# Altium project VXL_main.PrjPcb
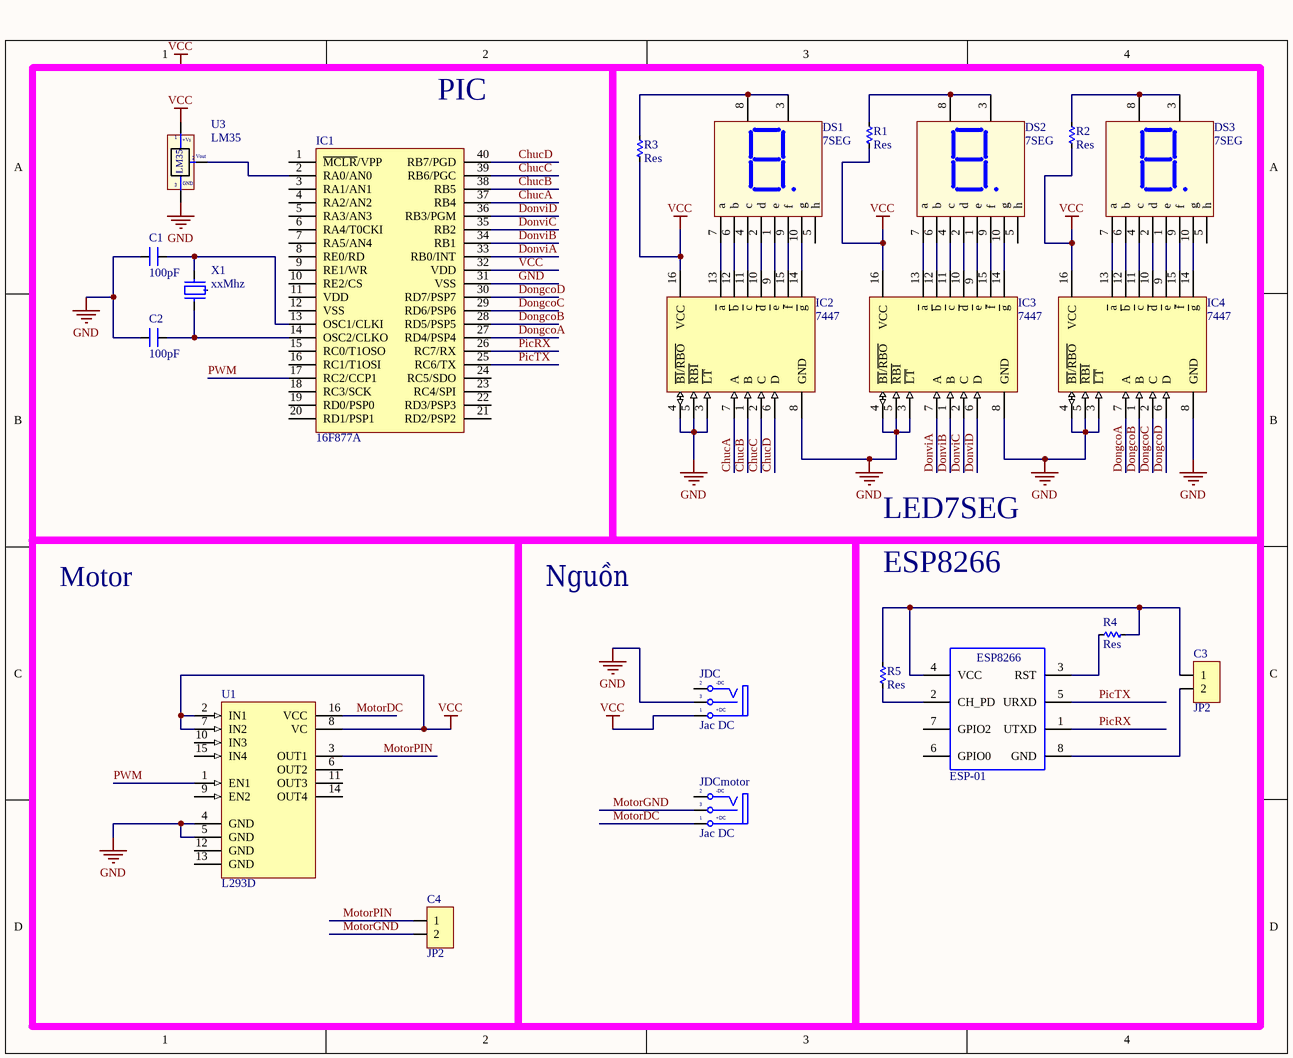
[diagram p0: AT long bus (13.3 x 4.2 inches).schdoc]
1 sheet, 22 parts. Net scope: global (net labels, ports and power ports of the same name join across sheets).
Board file: AT long bus (13.3 x 4.2 inches).PCBDOC

## Sheet AT long bus (13.3 x 4.2 inches).schdoc: AT long bus (13.3 x 4.2 inches)
size A; Organization: Organization; Address1: Address1; Address2: Address2; Address3: Address3; Address4: Address4; DocumentNumber: 1; Revision: 0; SheetNumber: 2; SheetTotal: 2

### Parts
C1  100pF  [CN1]
C2  100pF  [CN1]
C3  JP2  [JP2-C1T]
C4  JP2  [JP2-C1T]
DS1  7SEG  [LED7SEG-1-0.56]
DS2  7SEG  [LED7SEG-1-0.56]
DS3  7SEG  [LED7SEG-1-0.56]
IC1  16F877A  [DIP40/W0.6]
IC2  7447  [DIP16/W0.3]
IC3  7447  [DIP16/W0.3]
IC4  7447  [DIP16/W0.3]
JDC  Jac DC  [DC-IN]
JDCmotor  Jac DC  [DC0]
R1  Res  [RES-1/2W]
R2  Res  [RES-1/2W]
R3  Res  [RES-1/2W]
R4  Res  [RES-1/2W]
R5  Res  [RES-1/2W]
U1  L293D  [DIP16]
U2  ESP-01  [ESP8266]
U3  LM35  [TO92-123]
X1  xxMhz  [XT3]

### Blocks framed on the sheet
PIC: C1 C2 IC1 U3 X1
LED7SEG: DS1-DS3 IC2-IC4 R1-R3
Motor: C4 U1
Nguồn: JDC JDCmotor

### Nets
GND: C1.1 C2.1 IC1.31(VSS) IC2.3(~{LT}) IC2.4(~{BI}/~{RBO}) IC2.5(~{RBI}) IC2.8(GND) IC3.3(~{LT}) IC3.4(~{BI}/~{RBO}) IC3.5(~{RBI}) IC3.8(GND) IC4.3(~{LT}) IC4.4(~{BI}/~{RBO}) IC4.5(~{RBI}) IC4.8(GND) JDC.3(S) U1.4(GND) U1.5(GND) U3.3(-)
VCC: IC1.32(VDD) IC2.16(VCC) IC3.16(VCC) IC4.16(VCC) JDC.1(T) R1.2 R2.2 R3.2 U1.2(IN1) U1.7(IN2) U1.8(VC) U3.1(+Vs)
ChucA: IC1.37(RB4) IC2.7(A)
ChucB: IC1.38(RB5) IC2.1(B)
ChucC: IC1.39(RB6/PGC) IC2.2(C)
ChucD: IC1.40(RB7/PGD) IC2.6(D)
DongcoA: IC1.27(RD4/PSP4) IC4.7(A)
DongcoB: IC1.28(RD5/PSP5) IC4.1(B)
DongcoC: IC1.29(RD6/PSP6) IC4.2(C)
DongcoD: IC1.30(RD7/PSP7) IC4.6(D)
DonviA: IC1.33(RB0/INT) IC3.7(A)
DonviB: IC1.34(RB1) IC3.1(B)
DonviC: IC1.35(RB2) IC3.2(C)
DonviD: IC1.36(RB3/PGM) IC3.6(D)
MotorDC: JDCmotor.1(T) U1.16(VCC)
MotorGND: C4.2 JDCmotor.3(S)
MotorPIN: C4.1 U1.3(OUT1)
PicRX: IC1.26(RC7/RX) U2.1(UTXD)
PicTX: IC1.25(RC6/TX) U2.5(URXD)
PWM: IC1.17(RC2/CCP1) U1.1(EN1)
NetC1_2: C1.2 IC1.13(OSC1/CLKI) X1.2
NetC2_2: C2.2 IC1.14(OSC2/CLKO) X1.1
NetC3_1: C3.1 R4.1 R5.1 U2.4(VCC)
NetC3_2: C3.2 U2.8(GND)
NetDS1_1: DS1.1(e) IC2.9(~{e})
NetDS1_2: DS1.2(d) IC2.10(~{d})
NetDS1_3: DS1.3(Vcc) DS1.8(Vcc) R3.1
NetDS1_4: DS1.4(c) IC2.11(~{c})
NetDS1_6: DS1.6(b) IC2.12(~{b})
NetDS1_7: DS1.7(a) IC2.13(~{a})
NetDS1_9: DS1.9(f) IC2.15(~{f})
NetDS1_10: DS1.10(g) IC2.14(~{g})
NetDS2_1: DS2.1(e) IC3.9(~{e})
NetDS2_2: DS2.2(d) IC3.10(~{d})
NetDS2_3: DS2.3(Vcc) DS2.8(Vcc) R1.1
NetDS2_4: DS2.4(c) IC3.11(~{c})
NetDS2_6: DS2.6(b) IC3.12(~{b})
NetDS2_7: DS2.7(a) IC3.13(~{a})
NetDS2_9: DS2.9(f) IC3.15(~{f})
NetDS2_10: DS2.10(g) IC3.14(~{g})
NetDS3_1: DS3.1(e) IC4.9(~{e})
NetDS3_2: DS3.2(d) IC4.10(~{d})
NetDS3_3: DS3.3(Vcc) DS3.8(Vcc) R2.1
NetDS3_4: DS3.4(c) IC4.11(~{c})
NetDS3_6: DS3.6(b) IC4.12(~{b})
NetDS3_7: DS3.7(a) IC4.13(~{a})
NetDS3_9: DS3.9(f) IC4.15(~{f})
NetDS3_10: DS3.10(g) IC4.14(~{g})
NetIC1_2: IC1.2(RA0/AN0) U3.2(Vout)
NetR4_2: R4.2 U2.3(RST)
NetR5_2: R5.2 U2.2(CH_PD)

Not connected (* = marked no-connect by the designer): DS1 5(h); DS2 5(h); DS3 5(h); IC1 1(~{MCLR}/VPP) 3(RA1/AN1) 4(RA2/AN2) 5(RA3/AN3) 6(RA4/T0CKI) 7(RA5/AN4) 8(RE0/RD) 9(RE1/WR) 10(RE2/CS) 11(VDD) 12(VSS) 15(RC0/T1OSO) 16(RC1/T1OSI) 18(RC3/SCK) 19(RD0/PSP0) 20(RD1/PSP1) 21(RD2/PSP2) 22(RD3/PSP3) 23(RC4/SPI) 24(RC5/SDO); JDC 2(TN); JDCmotor 2(TN); U1 6(OUT2) 9(EN2) 10(IN3) 11(OUT3) 12(GND) 13(GND) 14(OUT4) 15(IN4); U2 6(GPIO0) 7(GPIO2); X1 3

### Notes on the sheet
- ESP8266
- Labels drawn without touching a wire or pin: VCC
- (in symbol DCIN) -DC; +DC
- (in symbol ESP8266-01) ESP8266
- (in symbol LM35) GND

### Library data of the parts
C1 C2 = CN1: Cap np  1pF - 472pF; Value: 100pF
C3 C4 = JP2: WR-PHD 2.54 mm Angled Socket Header; Manufacturer: W¨¹rth Elektronik eiSos GmbH; partNo: 613002143121; ComponentLink1 Description: Manufacturer; ComponentLink2 Description: Datasheet; NoPins: 02; Created Date: 29 March 2013; ComponentLink1URL: http://www.we-online.com; ComponentLink2URL: http://katalog.we-online.de/em/datasheet/6130xx143121.pdf; Created by: Karrer Zheng
DS1-DS3 = LED7SEG-1: 14.2 mm General Purpose Blue 7-Segment Display: CC, RH DP, Gray Surface; MinimumIntensity: 2020 ucd; Note: IF = 10 mA; Published: 8-Jun-2000; LatestRevisionDate: 17-Dec-2003; LatestRevisionNote: Schematic revised, PCB Footprint replaced.; DatasheetDocument: 24-Sep-2002; PackageDocument: 24-Sep-2002; PackageReference: H; Publisher: Altium Limited; Colour: Blue; ComponentLink1Description: Manufacturer Link; ComponentLink1URL: http://www.agilent.com/
IC1 = 16F877: 8K FLASH, 368B RAM, 256B EFROM; Value: PIC16F877A; Value: DIP 40; Copyright by: VanDungEvn
IC2-IC4 = 7447: BCD to 7-Segment Decoder/Driver; Value: 7447 , 74247
JDC JDCmotor = DCIN: Jac DC input; Value: Jac DC
R1-R5 = Res: Manufacturer: Generic Components; Class: Passive; SubClass: R; Published: 08/06/2000; Publisher: Altium Hobart Technology Centre
U1 = L293D: Push-Pull Four Channel Driver With Diode; Published: 8-Jun-2000; LatestRevisionDate: 06-Jun-2005; LatestRevisionNote: Stylized 3D Model Added.; DatasheetVersion: Jun-1996; PackageVersion: Apr-1996; PackageReference: DIP16; Publisher: Altium Limited; PackageDescription: DIP; 16 Leads; Row Spacing 7.62 mm; Pitch 2.54 mm; ComponentLink1Description: Manufacturer Link; ComponentLink1URL: http://www.st.com/; ComponentLink2Description: Datasheet; ComponentLink2URL: http://www.st.com/stonline/products/literature/ds/1330/l293d.pdf
U2 = ESP8266-01: ESP-12 Wi-Fi Module
U3 = LM35: Teminal; Value: LM35
X1 = XT3: Crystal For all Crystal 2pin.; Value: 4Mhz